# Altium schematic sheet 01-Revision_History_and_Contents.SchDoc: Revision History and Contents
size A; Date: 4/25/2017; ApprovedBy: JSK; CheckedBy: JSK; Author: JSK; CompanyName: University of Wisconsin; DrawnBy: JSK; Engineer: JSK; Organization: ECE 315; Address1: College of Engineering; Address2: 1415 Engineering Drive; Address3: Madison, WI 53706; Address4: ECE 453 Spring 2017; Revision: A; SheetNumber: 1; SheetTotal: 2; MachineName: ECE315-S19; PCBNumber: 001
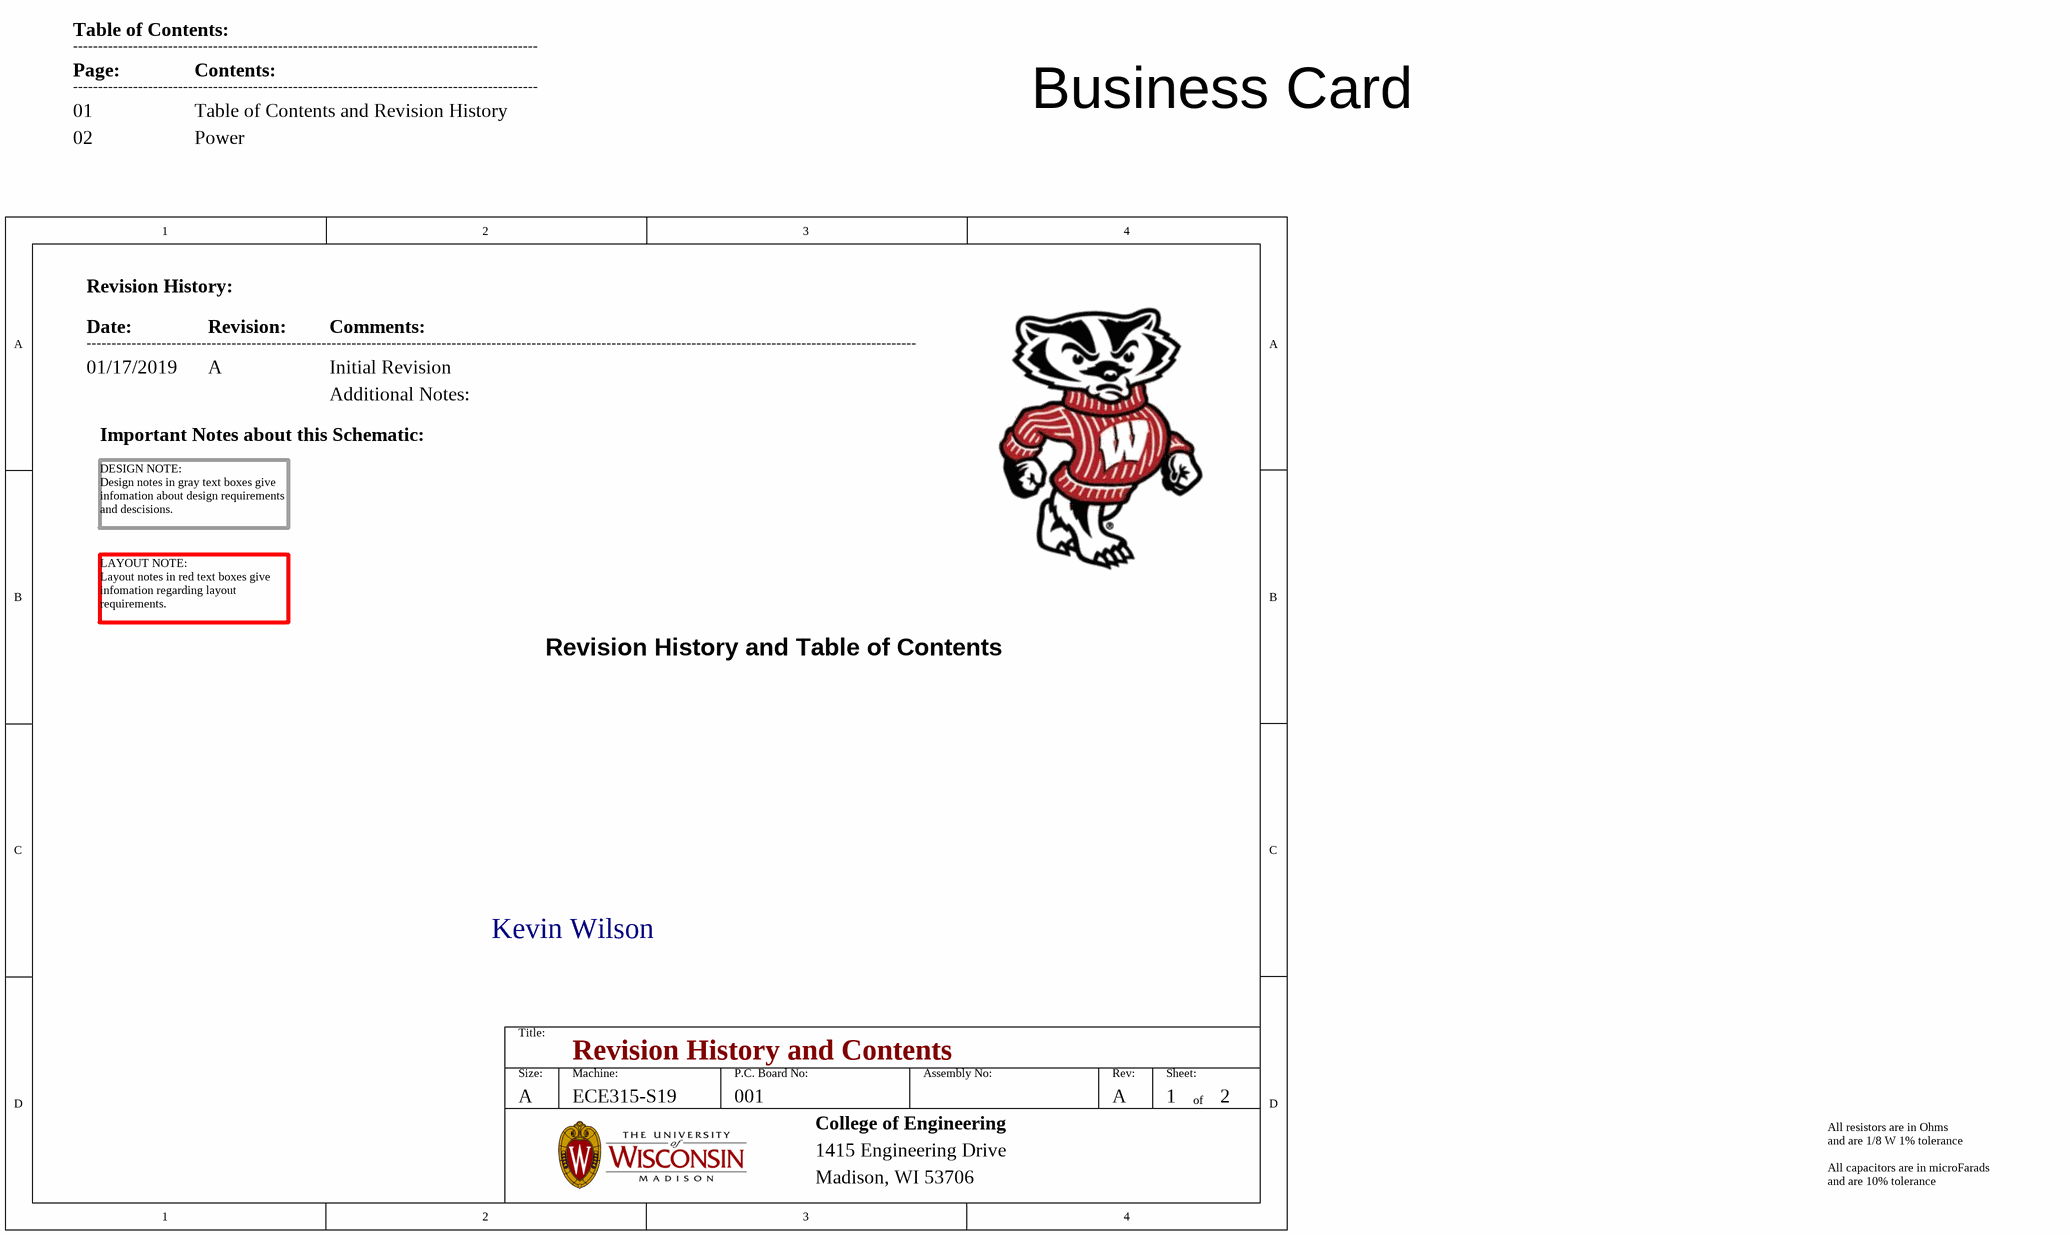
[diagram p0: 01-Revision_History_and_Contents.SchDoc]

## Parts
PCB1  PMOD F14 REV A  (value not drawn)  (mechanical)

## Notes on the sheet
- Table of Contents:
- Page:
- ---------------------------------------------------------------------------------------------
- Contents:
- 01
- 02
- Table of Contents and Revision History
- Power
- Business Card
- Revision History:
- Date:
- 01/17/2019
- ----------------------------------------------------------------------------------------------------------------------------------------------------------------------
- Revision:
- A
- Comments:
- Initial Revision
- Important Notes about this Schematic:
- Additional Notes:
- DESIGN NOTE:
  Design notes in gray text boxes give infomation about design requirements and descisions.
- LAYOUT NOTE:
  Layout notes in red text boxes give infomation regarding layout requirements.
- Revision History and Table of Contents
- Kevin Wilson
- All resistors are in Ohms
- and are 1/8 W 1% tolerance
- All capacitors are in microFarads
- and are 10% tolerance
- Title:
- Size:
- Machine:
- P.C. Board No:
- Assembly No:
- Rev:
- Sheet:
- of
- College of Engineering
- 1415 Engineering Drive
- Madison, WI 53706

## Library data of the parts
PCB1 = PMOD F14 Rev A Bare PCB: ECE 453 Digital Themometer PMOD F14 Rev A Bare PCB; Manufacturer 1: TBD; Supplier 1: TBD; Supplier Part Number 1: N/A; Manufacturer Part Number 1: PMOD F14 REV A; Supplier Unit Price 1: 33; Package: N/A; Tolerance: N/A; Rating: N/A